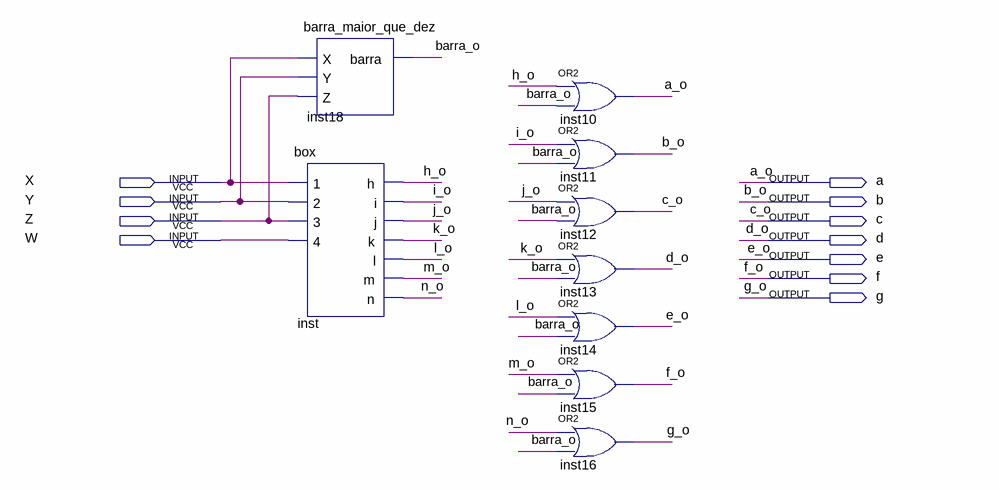
[diagram p0: schematic sheet]
// Quartus schematic bcd.bdf as structural Verilog: 9 symbols, 11 pins
module bcd (
  input  X,
  input  Y,
  input  Z,
  input  W,
  output a,
  output b,
  output c,
  output d,
  output e,
  output f,
  output g
);

  wire barra_o, h_o, i_o, j_o, k_o, l_o, m_o, n_o;

  barra_maior_que_dez inst18 (.X(X), .Y(Y), .Z(Z), .barra(barra_o));
  box inst (.\1 (X), .\2 (Y), .\3 (Z), .\4 (W), .h(h_o), .i(i_o), .j(j_o), .k(k_o), .l(l_o), .m(m_o), .n(n_o));
  or inst10 (a, h_o, barra_o);
  or inst11 (b, i_o, barra_o);
  or inst12 (c, j_o, barra_o);
  or inst13 (d, k_o, barra_o);
  or inst14 (e, l_o, barra_o);
  or inst15 (f, m_o, barra_o);
  or inst16 (g, n_o, barra_o);

  // Other names for the same wires on the sheet: a_o = a; b_o = b; c_o = c; d_o = d; e_o = e; f_o = f; g_o = g
endmodule
